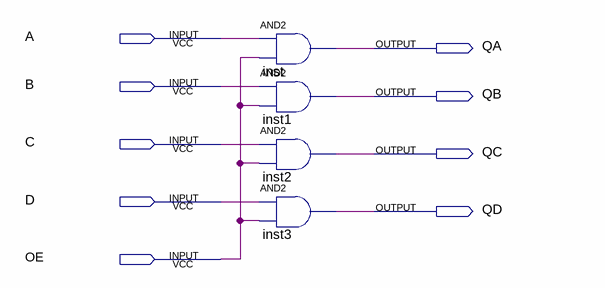
[diagram p0: schematic sheet]
// Quartus schematic activator.bdf as structural Verilog: 4 symbols, 9 pins
module activator (
  input  A,
  input  B,
  input  C,
  input  D,
  input  OE,
  output QA,
  output QB,
  output QC,
  output QD
);

  and inst (QA, A, OE);
  and inst1 (QB, B, OE);
  and inst2 (QC, C, OE);
  and inst3 (QD, D, OE);
endmodule
